# Altium schematic sheet USB_UART.SchDoc
size A
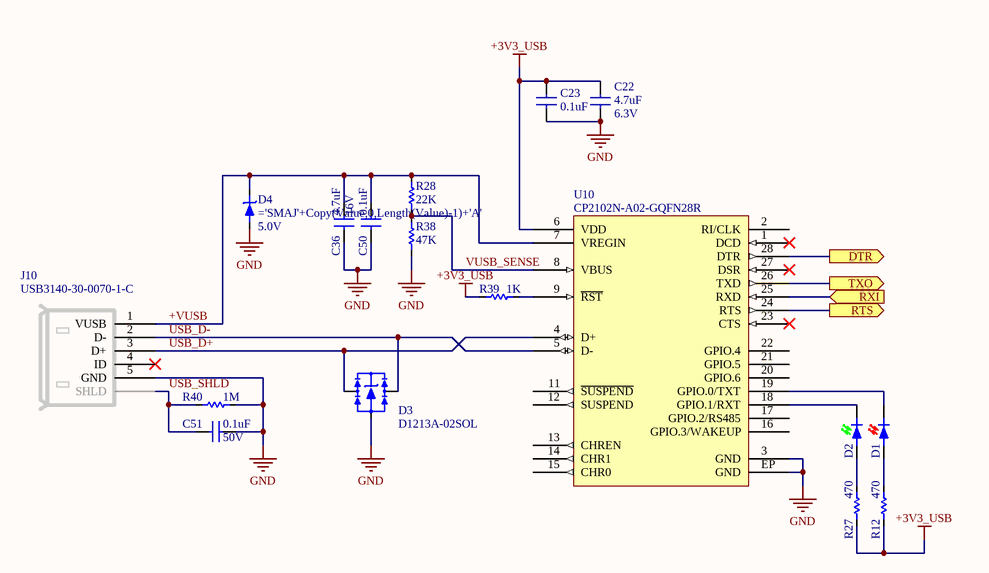
[diagram p0: USB_UART.SchDoc]

## Parts
C22  value 4.7uF  Voltage: 6.3V  [0603_Capacitor]  (hidden comment: CAP 4.7uF 6.3V X5R)
C23  value 0.1uF  [0402_CAPACITOR]  (hidden comment: CAP 0.1uF 16V X7R)
C36  value 4.7uF  Voltage: 16V  [0805_Capacitor]  (hidden comment: CAP 4.7uF 16V X5R)
C50  value 0.1uF  [0402_CAPACITOR]  (hidden comment: CAP 0.1uF 16V X7R)
C51  value 0.1uF  Voltage: 50V  [0603_CAPACITOR]  (hidden comment: CAP 0.1uF 50V X7R)
D1  LTST-C194KRKT  [0603_LED_Red]  (value not drawn)
D2  LTST-C194KGKT  [0603_LED_Green]  (value not drawn)
D3  D1213A-02SOL  [SOT23-3]
D4  value 5.0V  [SMA]  (hidden comment: TVS Diode)
J10  USB3140-30-0070-1-C  [J_USB3140-30-0070-1-C]
R12  value 470  [0402_Resistor]  (hidden comment: R_0402_470_1%)
R27  value 470  [0402_Resistor]  (hidden comment: R_0402_470_1%)
R28  value 22K  [0402_Resistor]  (hidden comment: R_0402_22K_1%)
R38  value 47K  [0402_Resistor]  (hidden comment: R_0402_47K_1%)
R39  value 1K  [0402_Resistor]  (hidden comment: R_0402_1K_1%)
R40  value 1M  [0603_Resistor]  (hidden comment: R_0603_1M_1%)
U10  CP2102N-A02-GQFN28R  [QFN-28-EP_5x5mm]

## Ports
DTR (out), RTS (out), RXI (in), TXO (out)

## Nets
+3V3_USB: C22.2 C23.1 R12.2 R27.2 R39.1 U10.6(VDD)
GND: C22.1 C23.2 C36.1 C50.2 C51.1 D3.3 D4.1(Anode) J10.5(GND) R38.1 R40.2 U10.3(GND) U10.EP(GND)
+VUSB: C36.2 C50.1 D4.2(Cathode) J10.1(VUSB) R28.2 U10.7(VREGIN)
DTR: U10.28(DTR) ; port DTR
RTS: U10.24(RTS) ; port RTS
RXI: U10.25(RXD) ; port RXI
TXO: U10.26(TXD) ; port TXO
USB_D+: D3.1 J10.3(D+) U10.4(D+)
USB_D-: D3.2 J10.2(D-) U10.5(D-)
USB_SHLD: C51.2 J10.SHLD R40.1
VUSB_SENSE: R28.1 R38.2 U10.8(VBUS)
NetD1_1: D1.1(Anode) R12.1
NetD1_2: D1.2(Cathode) U10.19(GPIO.0/TXT)
NetD2_1: D2.1(Anode) R27.1
NetD2_2: D2.2(Cathode) U10.18(GPIO.1/RXT)
NetR39_2: R39.2 U10.9(~{RST})

Not connected (* = marked no-connect by the designer): J10 4(ID)*; U10 1(DCD)* 2(RI/CLK) 11(~{SUSPEND}) 12(SUSPEND) 13(CHREN) 14(CHR1) 15(CHR0) 16(GPIO.3/WAKEUP) 17(GPIO.2/RS485) 20(GPIO.6) 21(GPIO.5) 22(GPIO.4) 23(CTS)* 27(DSR)*

## Library data of the parts
C22 = C_0603_4.7uF_6.3V_10%: CAP CER 4.7UF 6.3V X5R 0603; Package: =SelectedPackage; Temperature Coefficient: X5R; Supplier 1: Digi-Key; Supplier Part Number 1: 1276-1045-1-ND
C23 C50 = C_0402_0.1uF_16V_10%: CAP CERM 0.1uF 10% 16V 0402; Package: =SelectedPackage; Voltage: 16V; Temperature Coefficient: X7R; Supplier 1: Digi-Key; Supplier Part Number 1: 1276-1001-1-ND; Supplier 2: Digi-Key; Supplier Part Number 2: 587-1451-1-ND
C36 = C_0805_4.7uF_16V_10%: CAP CERM 4.7uF 10% 16V 0805; SVP Creator: Spencer Berglund; Package: =SelectedPackage; Temperature Coefficient: X5R; Supplier 1: Digi-Key; Supplier Part Number 1: 1276-1065-6-ND
C51 = C_0603_0.1uF_50V_10%: CAP CERM 0.1uF 10% 50V 0603; SVP Creator: Spencer Berglund; Package: =SelectedPackage; Temperature Coefficient: X7R; Supplier 1: Digi-Key; Supplier Part Number 1: 1276-1000-1-ND
D1 = D_LED_0603_Red: Red 631nm LED Indication - Discrete 2V 0603 (1608 Metric); Manufacturer: Vishay Lite-On; Lens Transparency: Clear; Lens Colour: Colorless; Reverse Voltage: 5V; Forward Current: 5mA; Power Dissipation: 75mW; Luminous Intensity: 95.6mcd; Test Current: 20mA; Viewing Angle: 130°; Value: Red; Manufacturer Part Number: LTST-C194KRKT; Min Operating Temperature: -30°C; Forward Voltage: 2V; Max Operating Temperature: 85°C; Dominant Wavelength: 631nm; Supplier 1: Digi-Key; Supplier Part Number 1: 160-1835-1-ND
D2 = D_LED_0603_Green: Green 572nm LED Indication - Discrete 2.1V 0603 (1608 Metric); Manufacturer: Vishay Lite-On; Lens Transparency: Clear; Lens Colour: Colorless; Reverse Voltage: 5V; Forward Current: 30mA; Power Dissipation: 75mW; Luminous Intensity: 112mcd; Forward Voltage: 2.4V; Test Current: 20mA; Viewing Angle: 130°; Dominant Wavelength: 576.5nm; Value: Green; Manufacturer Part Number: LTST-C194KGKT; Min Operating Temperature: -30°C; Max Operating Temperature: 85°C; Supplier 1: Digi-Key; Supplier Part Number 1: 160-1834-1-ND
D3 = D_D1213A-02SOL: 10V (Typ) Clamp 1A (8/20µs) Ipp Tvs Diode Surface Mount SOT-23 (for USB); Manufacturer: Diodes Incorporated; Type: Steering (Rail to Rail); Voltage - Breakdown (Min): 6V; Capacitance @ Frequency: 0.85pF @ 1MHz; Voltage - Reverse Standoff (Typ): 3.3V; Manufacturer Part Number: D1213A-02SOL; Voltage - Clamping (Max) @ Ipp: 10V (Typ); Current - Peak Pulse (10/1000µs): 1A (8/20µs); Operating Temperature: -40°C ~ 85°C (TA)
D4 = D_TVS_SMAJ_Uni_generic: SMA Unidirectional TVS Diode; Manufacturer: Vishay; Power - Peak Pulse: 400W; Type: Zener; Operating Temperature: -55°C ~ 150°C; HelpURL: http://www.vishay.com/docs/88392/smbj.pdf; Manufacturer PN: ='SMAJ'+Copy(Value,0,Length(Value)-1)+'A'
J10 = J_USB3140-30-0070-1-C: USB - micro B USB 2.0 Receptacle Connector 5 Position Surface Mount, Through Hole; Supplier 1: Digi-Key; Supplier Part Number 1: 2073-USB3140-30-0070-1-CCT-ND
R12 R27 R28 R38 R39 = R_0402_generic_1%: Generic 0402 Resistor (10.2R to 10M); Manufacturer: Yageo; Power Rating: 0.0625W; Temperature Coefficient: ±100ppm/°C; Tolerance: ±1%; Voltage Rating: 50V; Operating Temperature: -55°C ~ 155°C; Manufacturer Part Number: ='RC0402FR-07'+ValueFormatted+'L'; HelpURL: https://www.digikey.com/products/en/resistors/chip-resistor-surface-mount/52?pv17=103&FV=fffc000d%2Cc0001%2C1c0002%2C1f140000%2Cffe00034&k=RC0402; ValueFormatted: =Copy(Copy(Value, 0, Pos('.', Value)-1)+Copy(Value, Length(Value), 1)+Copy(Value, Pos('.', Value)+1, Length(Value)-Pos('.', Value)-1),1,Pos('.',Value)*Length(Value))+Copy(Value,1,Length(Value)*(1-Pos('.',Value)))
R40 = R_0603_generic_1%: Generic 0603 Resistor (10.2R to 10M); Manufacturer: Yageo; Power Rating: 0.1W; Temperature Coefficient: ±100ppm/°C; Tolerance: ±1%; Voltage Rating: 75V; Operating Temperature: -55°C ~ 155°C; Manufacturer Part Number: ='RC0603FR-07'+ValueFormatted+'L'; HelpURL: https://www.digikey.com/products/en/resistors/chip-resistor-surface-mount/52?pv17=103&FV=fffc000d%2Cc0001%2C1c0002%2C1f140000%2Cffe00034&k=RC0603; ValueFormatted: =Copy(Copy(Value, 0, Pos('.', Value)-1)+Copy(Value, Length(Value), 1)+Copy(Value, Pos('.', Value)+1, Length(Value)-Pos('.', Value)-1),1,Pos('.',Value)*Length(Value))+Copy(Value,1,Length(Value)*(1-Pos('.',Value)))
U10 = U_CP2102N-A02-GQFN28R: USB Bridge, USB to UART USB 2.0 UART Interface 28-QFN (5x5); Supplier 1: Digi-Key; Supplier 2: Mouser; Supplier Part Number 1: 336-5890-1-ND; Supplier Part Number 2: 634-CP2102NA02QFN28R